# Altium schematic sheet 5V-25V to 12V3A DC-DC Converter.SchDoc
size A4
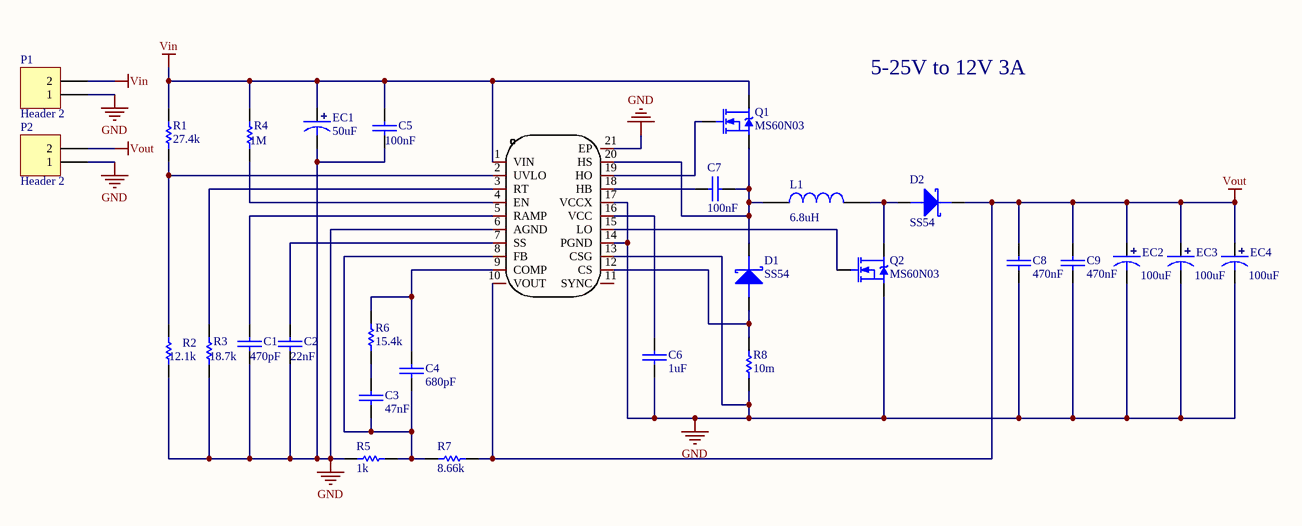
[diagram p0: 5V-25V to 12V3A DC-DC Converter.SchDoc]

## Parts
C1  470pF  [0402C]
C2  22nF  [0402C]
C3  47nF  [0402C]
C4  680pF  [0402C]
C5  100nF  [0402C]
C6  1uF  [0402C]
C7  100nF  [0402C]
C8  470nF  [0402C]
C9  470nF  [0402C]
D1  SS54  [肖特基二极管SS54]
D2  SS54  [肖特基二极管SS54]
EC1  50uF  [SMD-EC6.3X6.3X10]
EC2  100uF  [SMD-EC8X8X10]
EC3  100uF  [SMD-EC8X8X10]
EC4  100uF  [SMD-EC8X8X10]
L1  6.8uH  [0630L]
P1  Header 2  [HDR1X2]
P2  Header 2  [HDR1X2]
Q1  MS60N03  [TO252]
Q2  MS60N03  [TO252]
R1  27.4k  [0402R]
R2  12.1k  [0402R]
R3  18.7k  [0402R]
R4  1M  [0402R]
R5  1k  [0402R]
R6  15.4k  [0402R]
R7  8.66k  [0402R]
R8  10m  [1206R]
U1  LM25118MHX/NOPB  [LM25118]  (value not drawn)

## Nets
GND: C1.1 C2.1 C5.1 C6.1 C8.2 C9.2 EC1.2 EC2.2 EC3.2 EC4.2 P1.1 P2.1 Q2.S R2.1 R3.1 R5.1 R8.1 U1.6(AGND) U1.13(CSG) U1.14(PGND) U1.17(VCCX) U1.21(EP)
Vin: C5.2 EC1.1 P1.2 Q1.D R1.2 R4.2 U1.1(VIN)
Vout: C8.1 C9.1 D2.2 EC2.1 EC3.1 EC4.1 P2.2 R7.1 U1.10(VOUT)
NetC1_2: C1.2 U1.5(RAMP)
NetC2_2: C2.2 U1.7(SS)
NetC3_1: C3.1 C4.1 R5.2 R7.2 U1.8(FB)
NetC3_2: C3.2 R6.1
NetC4_2: C4.2 R6.2 U1.9(COMP)
NetC6_2: C6.2 U1.16(VCC)
NetC7_1: C7.1 D1.2 L1.1 Q1.S U1.20(HS)
NetC7_2: C7.2 U1.18(HB)
NetD1_1: D1.1 R8.2 U1.12(CS)
NetD2_1: D2.1 L1.2 Q2.D
NetQ1_G: Q1.G U1.19(HO)
NetQ2_G: Q2.G U1.15(LO)
NetR1_1: R1.1 R2.2 U1.2(UVLO)
NetR3_2: R3.2 U1.3(RT)
NetR4_1: R4.1 U1.4(EN)

Not connected (* = marked no-connect by the designer): U1 11(SYNC)

## Notes on the sheet
- 5-25V to 12V 3A

## Library data of the parts
C1-C9 = CAP: 无极性电容
D1 D2 = DIODE SCHOTTKY: 肖特基二极管
EC1-EC4 = SMD_ECAP: 贴片电解电容
L1 = INDUCTOR
P1 P2 = Header 2: Header, 2-Pin; LatestRevisionDate: 17-Jul-2002; LatestRevisionNote: Re-released for DXP Platform.; Publisher: Altium Limited
Q1 Q2 = N-MOS: N沟道场效应管
R1-R7 = RES
R8 = RES: P>0.2w
U1 = LM25118MHX/NOPB: Manufacturer: TI(德州仪器); Add into BOM: yes; Function: 升压型；降压型; Synchronous Rectification: 否; Number of Outputs: 1; Topology: 升压式；降压式; Input Voltage: 3V~42V; Switching Frequency: 500kHz; Duty Cycle (Max): 75%; Name: LM25118MHX/NOPB; Symbol: LM25118MHX/NOPB; Device: LM25118MHX/NOPB; LCSC Part Name: 降压型 升压型 3V~42V 500kHz; Supplier Part: C470962; Manufacturer Part: LM25118MHX/NOPB; Supplier Footprint: HTSSOP-20-EP; JLCPCB Part Class: Extended Part; Datasheet: https://atta.szlcsc.com/upload/public/pdf/source/20191219/C470962_B4E0B445A5DDC9BDA17A6FD2A579B975.pdf; Supplier: LCSC; Convert to PCB: yes; Operating Temperature: -40℃~+125℃@(TJ)